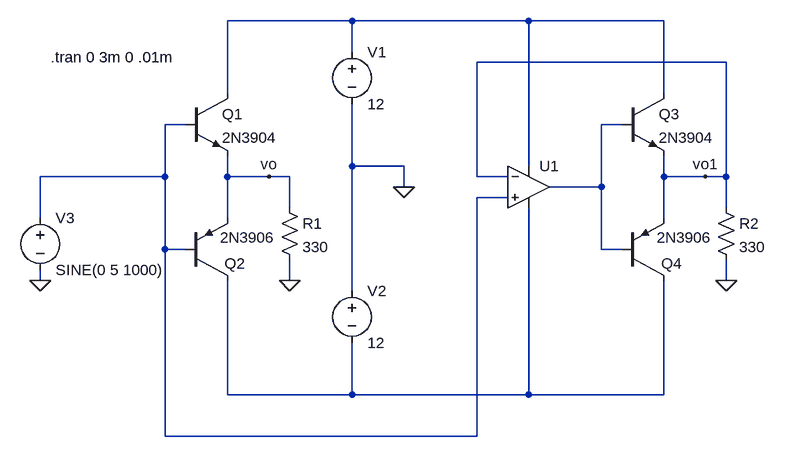
[diagram p0: schematic teoria4.asc]
teoria4.asc, the LTspice schematic file:
Version 4
SHEET 1 1092 680
WIRE 448 -32 256 -32
WIRE 720 -32 448 -32
WIRE 928 -32 720 -32
WIRE 448 16 448 -32
WIRE 1024 32 640 32
WIRE 256 80 256 -32
WIRE 928 80 928 -32
WIRE 192 128 160 128
WIRE 864 128 832 128
WIRE 448 192 448 96
WIRE 528 192 448 192
WIRE 720 192 720 -32
WIRE 160 208 160 128
WIRE 160 208 -32 208
WIRE 256 208 256 176
WIRE 320 208 256 208
WIRE 352 208 320 208
WIRE 640 208 640 32
WIRE 688 208 640 208
WIRE 928 208 928 176
WIRE 992 208 928 208
WIRE 1024 208 1024 32
WIRE 1024 208 992 208
WIRE 528 224 528 192
WIRE 832 224 832 128
WIRE 832 224 752 224
WIRE 688 240 640 240
WIRE 352 256 352 208
WIRE 1024 256 1024 208
WIRE -32 272 -32 208
WIRE 256 272 256 208
WIRE 928 272 928 208
WIRE 160 320 160 208
WIRE 192 320 160 320
WIRE 832 320 832 224
WIRE 864 320 832 320
WIRE -32 368 -32 352
WIRE 352 368 352 336
WIRE 1024 368 1024 336
WIRE 448 384 448 192
WIRE 256 544 256 368
WIRE 448 544 448 464
WIRE 448 544 256 544
WIRE 720 544 720 256
WIRE 720 544 448 544
WIRE 928 544 928 368
WIRE 928 544 720 544
WIRE 160 608 160 320
WIRE 640 608 640 240
WIRE 640 608 160 608
FLAG 352 368 0
FLAG 528 224 0
FLAG 320 208 vo
FLAG -32 368 0
FLAG 1024 368 0
FLAG 992 208 vo1
SYMBOL npn 192 80 R0
SYMATTR InstName Q1
SYMATTR Value 2N3904
SYMBOL pnp 192 368 M180
WINDOW 0 60 26 Left 2
WINDOW 3 53 66 Left 2
SYMATTR InstName Q2
SYMATTR Value 2N3906
SYMBOL voltage 448 0 R0
WINDOW 123 0 0 Left 0
WINDOW 39 0 0 Left 0
SYMATTR InstName V1
SYMATTR Value 12
SYMBOL voltage 448 368 R0
WINDOW 123 0 0 Left 0
WINDOW 39 0 0 Left 0
SYMATTR InstName V2
SYMATTR Value 12
SYMBOL res 336 240 R0
SYMATTR InstName R1
SYMATTR Value 330
SYMBOL voltage -32 256 R0
WINDOW 123 0 0 Left 0
WINDOW 39 0 0 Left 0
SYMATTR InstName V3
SYMATTR Value SINE(0 5 1000)
SYMBOL npn 864 80 R0
SYMATTR InstName Q3
SYMATTR Value 2N3904
SYMBOL pnp 864 368 M180
WINDOW 0 60 26 Left 2
WINDOW 3 53 66 Left 2
SYMATTR InstName Q4
SYMATTR Value 2N3906
SYMBOL res 1008 240 R0
SYMATTR InstName R2
SYMATTR Value 330
SYMBOL Opamps\\UniversalOpamp2 720 224 R0
SYMATTR InstName U1
TEXT -16 24 Left 2 !.tran 0 3m 0 .01m

The netlist it stands for:
* teoria4.asc
Q1 N001 N002 vo 0 2N3904
Q2 N004 N002 vo 0 2N3906
V1 N001 0 12
V2 0 N004 12
R1 vo 0 330
V3 N002 0 SINE(0 5 1000)
Q3 N001 N003 vo1 0 2N3904
Q4 N004 N003 vo1 0 2N3906
R2 vo1 0 330
XU1 N002 vo1 N001 N004 N003 level.2 Avol=1Meg GBW=10Meg Slew=10Meg ilimit=25m rail=0 Vos=0 phimargin=45 en=0 enk=0 in=0 ink=0 Rin=500Meg  ; pins IN+ IN- V+ V- OUT
.model NPN NPN
.model PNP PNP
.lib standard.bjt
.tran 0 3m 0 .01m
.lib UniversalOpamps2.sub
.backanno
.end